# Altium schematic sheet SLT3-PAY-1Q2T_P2.SchDoc: SVPXFMC Carrier 3U
size A4; CheckedBy: \; Author: G.Kasprowicz; CompanyName: ISE; DrawnBy: T.Przywozki; Organization: WUT ISE; Address1: Warsaw University of Technology; Address2: Nowowiejska 15/19 00-665 Warsaw; Revision: 1.0.; SheetNumber: 12; SheetTotal: 20; Project: SVPXFMC Carrier 3U; ModifiedBy: -; CheckedDate: -; Title2: SpaceVPX P2, SLT3-PAY-1Q2T; DivGrp: ISE; Designer: G. Kasprowicz
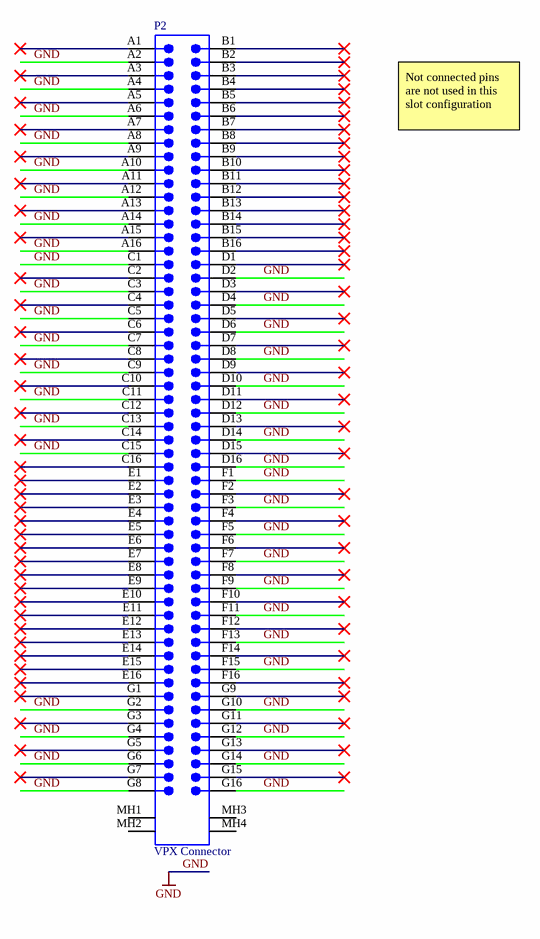
[diagram p0: SLT3-PAY-1Q2T_P2.SchDoc]

## Parts
P2  VPX Connector  [BTB1-8-4H112M]

## Nets
GND: P2.A2 P2.A4 P2.A6 P2.A8 P2.A10 P2.A12 P2.A14 P2.A16 P2.C1 P2.C3 P2.C5 P2.C7 P2.C9 P2.C11 P2.C13 P2.C15 P2.D2 P2.D4 P2.D6 P2.D8 P2.D10 P2.D12 P2.D14 P2.D16 P2.F1 P2.F3 P2.F5 P2.F7 P2.F9 P2.F11 P2.F13 P2.F15 P2.G2 P2.G4 P2.G6 P2.G8 P2.G10 P2.G12 P2.G14 P2.G16

Not connected (* = marked no-connect by the designer): P2 A1* A3* A5* A7* A9* A11* A13* A15* B1* B2* B3* B4* B5* B6* B7* B8* B9* B10* B11* B12* B13* B14* B15* B16* C2* C4* C6* C8* C10* C12* C14* C16* D1* D3* D5* D7* D9* D11* D13* D15* E1* E2* E3* E4* E5* E6* E7* E8* E9* E10* E11* E12* E13* E14* E15* E16* F2* F4* F6* F8* F10* F12* F14* F16* G1* G3* G5* G7* G9* G11* G13* G15* MH1 MH2 MH3 MH4

## Notes on the sheet
- Not connected pins are not used in this slot configuration
- Project/Equipment
- Document
- Designer
- Drawn by
- Check.by
- Copyright WUT ISE 2019
  This documentation describes Open Hardware and is licensed under the CERN OHL v.1.1. You may redistribute and modify this documentation under the terms of the CERN OHL v1.1.
  (http://ohwr.org/CERNOHL). This documentation is dristributed WITHOUT ANY EXPRESS OR IMPLIED WARRANTY, INCLUDING OF MERCHANTABILITY, SATISFACTORY QUALITY AND FITNESS FOR A PARTICULAR PURPOSE. Please see the CERN OHL v.1.1 for applicable conditions
- File
- Last Mod.
- Print Date
- Sheet
- Size
- A4
- of
- Rev

## Library data of the parts
P2 = 2102771-1: Ruggedized Board-to-Board Connector, Right Angle, 7-Row, Pitch 1.8mm, 112-Position; Manufacturer: TE; Bonding: No; ComponentHeigth: 14.7mm; PressFit: No; Case: *; Component Kind: Standard; Component Type: Standard; CreateDate: 2018-01-01; Device: *; Footprint: *; HelpURL: *; LatestRevisionDate: 2018-01-01; Manufacturer Part Number: 2102771-1; Mounted: Yes; PackageDescription: 2102771-1; Part Description: Ruggedized Board-to-Board Connector, Right Angle, 7-Row, Pitch 1.8mm, 112-Position; Part Number: 2102771-1; Pin Count: *; Sense: No; SMD: Yes; Socket: No; Family: VPX Connector